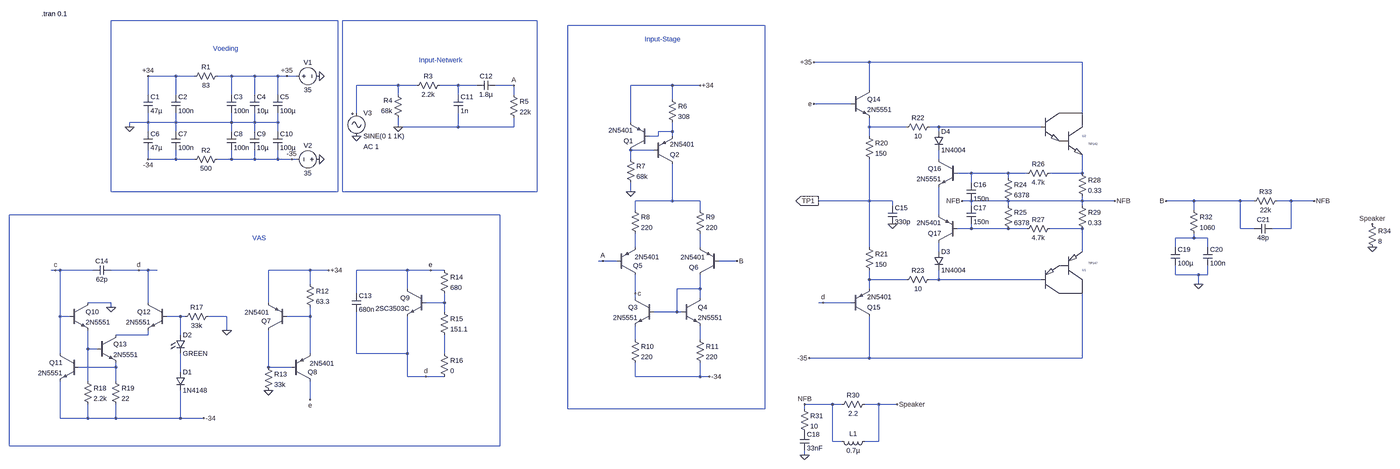
[diagram p0: schematic Lab_AB.asc, whole sheet]
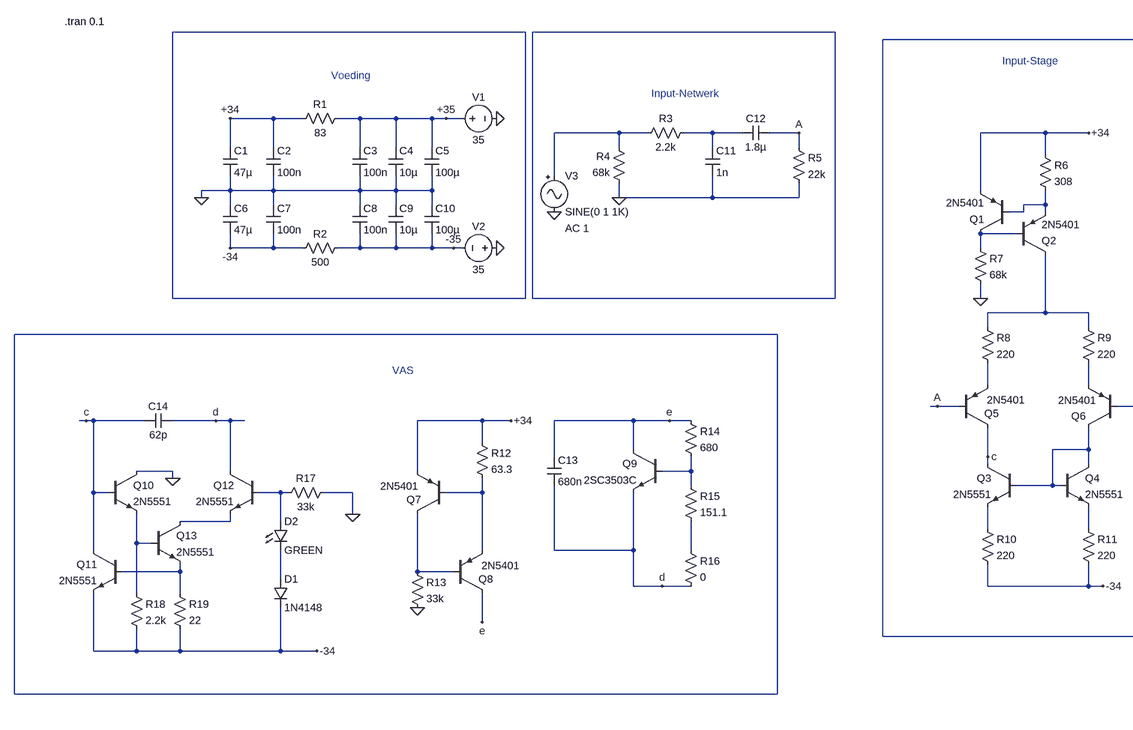
[diagram p1: schematic Lab_AB.asc, part, row 1 of 1, column 1 of 2]
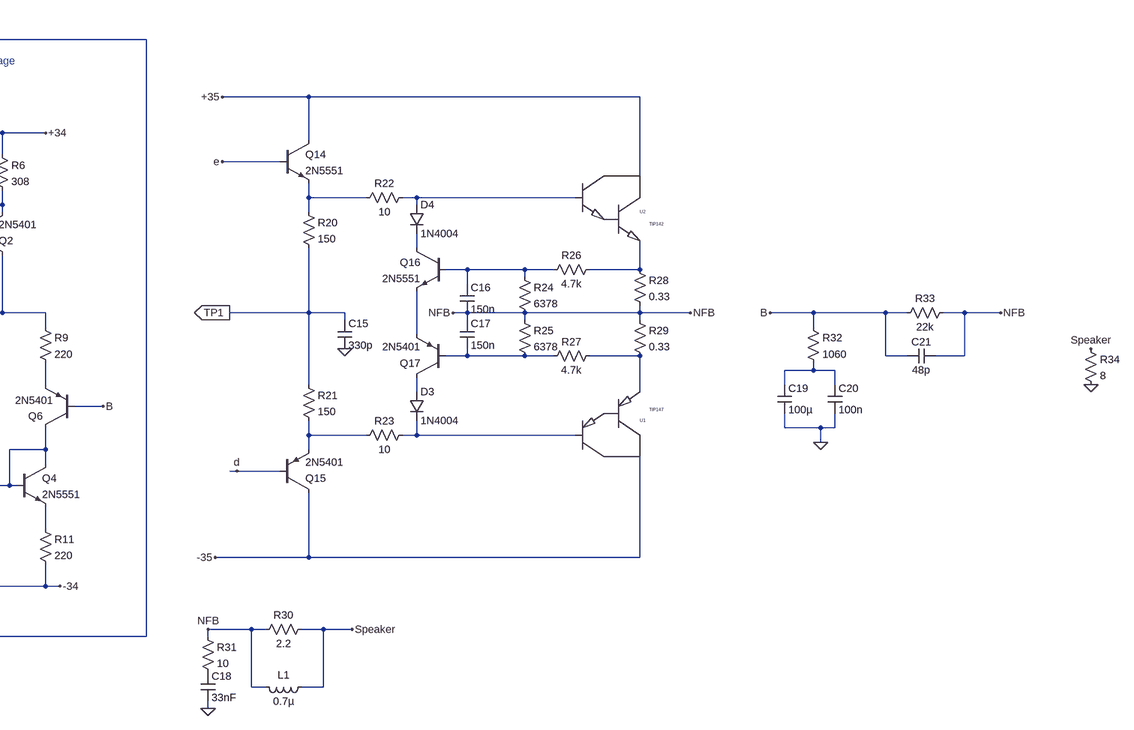
[diagram p2: schematic Lab_AB.asc, part, row 1 of 1, column 2 of 2]
Lab_AB.asc, the LTspice schematic file:
Version 4
SHEET 1 3780 2308
WIRE -128 -256 -912 -256
WIRE 560 -256 -112 -256
WIRE 1376 -240 688 -240
WIRE 1792 -112 1600 -112
WIRE 2528 -112 1792 -112
WIRE -688 -64 -784 -64
WIRE -624 -64 -688 -64
WIRE -496 -64 -544 -64
WIRE -416 -64 -496 -64
WIRE -336 -64 -416 -64
WIRE -304 -64 -336 -64
WIRE -272 -64 -304 -64
WIRE 80 -32 -64 -32
WIRE 144 -32 80 -32
WIRE 288 -32 224 -32
WIRE 352 -32 288 -32
WIRE 480 -32 416 -32
WIRE 1056 -32 912 -32
WIRE 1152 -32 1056 -32
WIRE 1792 -16 1792 -112
WIRE -784 0 -784 -64
WIRE -688 0 -688 -64
WIRE -496 0 -496 -64
WIRE -416 0 -416 -64
WIRE -336 0 -336 -64
WIRE 80 0 80 -32
WIRE 288 0 288 -32
WIRE 480 0 480 -32
WIRE 1056 16 1056 -32
WIRE 1728 32 1600 32
WIRE -64 64 -64 -32
WIRE 2528 64 2528 -112
WIRE -784 96 -784 64
WIRE -784 96 -848 96
WIRE -688 96 -688 64
WIRE -688 96 -784 96
WIRE -496 96 -496 64
WIRE -496 96 -688 96
WIRE -416 96 -416 64
WIRE -416 96 -496 96
WIRE -336 96 -336 64
WIRE -336 96 -416 96
WIRE 912 96 912 -32
WIRE -848 112 -848 96
WIRE 80 112 80 80
WIRE 288 112 288 64
WIRE 288 112 80 112
WIRE 480 112 480 80
WIRE 480 112 288 112
WIRE 1792 112 1792 80
WIRE 1920 112 1792 112
WIRE 2032 112 2000 112
WIRE 2384 112 2032 112
WIRE -784 128 -784 96
WIRE -688 128 -688 96
WIRE -496 128 -496 96
WIRE -416 128 -416 96
WIRE -336 128 -336 96
WIRE 1056 128 1056 96
WIRE 1056 128 1008 128
WIRE 2032 128 2032 112
WIRE 1008 144 1008 128
WIRE 1008 144 976 144
WIRE 1056 144 1056 128
WIRE 1792 144 1792 112
WIRE 992 192 912 192
WIRE -784 224 -784 192
WIRE -688 224 -688 192
WIRE -688 224 -784 224
WIRE -624 224 -688 224
WIRE -496 224 -496 192
WIRE -496 224 -544 224
WIRE -416 224 -416 192
WIRE -416 224 -496 224
WIRE -336 224 -336 192
WIRE -336 224 -416 224
WIRE -288 224 -336 224
WIRE -272 224 -288 224
WIRE 912 224 912 192
WIRE 2032 224 2032 192
WIRE 2144 272 2096 272
WIRE 2272 272 2144 272
WIRE 2336 272 2272 272
WIRE 2528 272 2528 208
WIRE 2528 272 2416 272
WIRE 2272 288 2272 272
WIRE 2144 304 2144 272
WIRE -912 336 -912 -256
WIRE -128 336 -128 -256
WIRE -128 336 -912 336
WIRE -112 336 -112 -256
WIRE 560 336 560 -256
WIRE 560 336 -112 336
WIRE 912 336 912 304
WIRE 1056 368 1056 240
WIRE 1056 368 928 368
WIRE 1152 368 1056 368
WIRE 1792 368 1792 224
WIRE 1792 368 1616 368
WIRE 1872 368 1792 368
WIRE 2144 368 2112 368
WIRE 2272 368 2144 368
WIRE 2528 368 2528 352
WIRE 2528 368 2272 368
WIRE 2640 368 2528 368
WIRE 2960 368 2864 368
WIRE 3120 368 2960 368
WIRE 3168 368 3120 368
WIRE 3296 368 3248 368
WIRE 3376 368 3296 368
WIRE 1872 384 1872 368
WIRE 2144 384 2144 368
WIRE 2272 384 2272 368
WIRE 2528 384 2528 368
WIRE 928 400 928 368
WIRE 1152 400 1152 368
WIRE 2960 400 2960 368
WIRE 432 416 -1264 416
WIRE 2032 416 2032 320
WIRE 2144 464 2144 448
WIRE 2144 464 2096 464
WIRE 2272 464 2144 464
WIRE 2336 464 2272 464
WIRE 2528 464 2416 464
WIRE 3120 464 3120 368
WIRE 3168 464 3120 464
WIRE 3296 464 3296 368
WIRE 3296 464 3232 464
WIRE 2960 496 2960 480
WIRE 2960 496 2896 496
WIRE 3008 496 2960 496
WIRE 928 528 928 480
WIRE 1152 528 1152 480
WIRE 1792 528 1792 368
WIRE 2896 528 2896 496
WIRE 3008 528 3008 496
WIRE 2032 544 2032 512
WIRE 2528 544 2528 464
WIRE 816 576 800 576
WIRE 864 576 816 576
WIRE 1280 576 1216 576
WIRE -1104 608 -1120 608
WIRE -1088 608 -1104 608
WIRE -976 608 -1088 608
WIRE -816 608 -912 608
WIRE -784 608 -816 608
WIRE -752 608 -784 608
WIRE -224 608 -368 608
WIRE -160 608 -224 608
WIRE 112 608 -64 608
WIRE 192 608 112 608
WIRE 240 608 192 608
WIRE 2896 624 2896 592
WIRE 2976 624 2896 624
WIRE 3008 624 3008 592
WIRE 3008 624 2976 624
WIRE 1792 640 1792 608
WIRE 1920 640 1792 640
WIRE 2032 640 2032 608
WIRE 2032 640 2000 640
WIRE 2384 640 2032 640
WIRE -224 656 -224 608
WIRE 2976 656 2976 624
WIRE 112 672 112 608
WIRE 1152 672 1152 624
WIRE 1152 672 1072 672
WIRE 1792 672 1792 640
WIRE -64 688 -64 608
WIRE 928 688 928 624
WIRE 928 704 928 688
WIRE 1152 704 1152 672
WIRE -912 720 -992 720
WIRE -784 720 -784 608
WIRE -368 720 -368 608
WIRE 240 720 240 688
WIRE 240 720 176 720
WIRE 1632 720 1616 720
WIRE 1728 720 1632 720
WIRE -912 736 -912 720
WIRE 240 752 240 720
WIRE 1072 752 1072 672
WIRE 1072 752 992 752
WIRE 1088 752 1072 752
WIRE -1088 768 -1088 608
WIRE -1056 768 -1088 768
WIRE -672 768 -720 768
WIRE -656 768 -672 768
WIRE -512 768 -576 768
WIRE -224 768 -224 736
WIRE -224 768 -304 768
WIRE -512 816 -512 768
WIRE -784 832 -784 816
WIRE -784 832 -896 832
WIRE -672 832 -672 768
WIRE 928 848 928 800
WIRE 1152 848 1152 800
WIRE -992 880 -992 816
WIRE -960 880 -992 880
WIRE -1088 896 -1088 768
WIRE -224 896 -224 768
WIRE -64 896 -64 752
WIRE 112 896 112 768
WIRE 112 896 -64 896
WIRE 240 896 240 832
WIRE 1792 912 1792 768
WIRE 1792 912 1584 912
WIRE 2528 912 2528 688
WIRE 2528 912 1792 912
WIRE -896 944 -896 928
WIRE -896 944 -1024 944
WIRE -368 944 -368 816
WIRE -288 944 -368 944
WIRE -672 960 -672 896
WIRE 112 976 112 896
WIRE 176 976 112 976
WIRE 240 976 176 976
WIRE 928 976 928 928
WIRE 1152 976 1152 928
WIRE 1152 976 928 976
WIRE 1184 976 1152 976
WIRE -992 992 -992 880
WIRE -896 992 -896 944
WIRE -224 1056 -224 992
WIRE 1664 1072 1568 1072
WIRE 1696 1072 1664 1072
WIRE 1824 1072 1776 1072
WIRE 1888 1072 1824 1072
WIRE 688 1088 688 -240
WIRE 1376 1088 1376 -240
WIRE 1376 1088 688 1088
WIRE 1568 1088 1568 1072
WIRE -1088 1120 -1088 992
WIRE -992 1120 -992 1072
WIRE -992 1120 -1088 1120
WIRE -896 1120 -896 1072
WIRE -896 1120 -992 1120
WIRE -672 1120 -672 1024
WIRE -672 1120 -896 1120
WIRE -592 1120 -672 1120
WIRE 1664 1200 1664 1072
WIRE 1696 1200 1664 1200
WIRE 1824 1200 1824 1072
WIRE 1824 1200 1776 1200
WIRE -1264 1216 -1264 416
WIRE 432 1216 432 416
WIRE 432 1216 -1264 1216
WIRE 1568 1248 1568 1232
FLAG -848 112 0
FLAG -192 224 0
FLAG -192 -64 0
FLAG -64 144 0
FLAG 80 112 0
FLAG 912 336 0
FLAG -368 1024 0
FLAG 176 976 d
FLAG 192 608 e
FLAG -912 736 0
FLAG -512 816 0
FLAG -816 608 d
FLAG -1104 608 c
FLAG -288 224 -35
FLAG -304 -64 +35
FLAG -784 -64 +34
FLAG -784 224 -34
FLAG -160 608 +34
FLAG -592 1120 -34
FLAG 480 -32 A
FLAG -224 1056 e
FLAG 928 688 c
FLAG 1616 368 TP1
IOPIN 1616 368 Out
FLAG 1872 448 0
FLAG 2112 368 NFB
FLAG 1568 1248 0
FLAG 1888 1072 Speaker
FLAG 1600 -112 +35
FLAG 1584 912 -35
FLAG 1632 720 d
FLAG 1600 32 e
FLAG 816 576 A
FLAG 2976 656 0
FLAG 3376 368 NFB
FLAG 2864 368 B
FLAG 1280 576 B
FLAG 3600 528 0
FLAG 3600 448 Speaker
FLAG 2640 368 NFB
FLAG 1568 1072 NFB
FLAG 1152 -32 +34
FLAG 1184 976 -34
SYMBOL cap -800 0 R0
SYMATTR InstName C1
SYMATTR Value 47µ
SYMBOL cap -704 0 R0
SYMATTR InstName C2
SYMATTR Value 100n
SYMBOL cap -512 0 R0
SYMATTR InstName C3
SYMATTR Value 100n
SYMBOL cap -432 0 R0
SYMATTR InstName C4
SYMATTR Value 10µ
SYMBOL cap -352 0 R0
SYMATTR InstName C5
SYMATTR Value 100µ
SYMBOL res -528 -80 R90
WINDOW 0 0 56 VBottom 2
WINDOW 3 32 56 VTop 2
SYMATTR InstName R1
SYMATTR Value 83
SYMBOL res -528 208 R90
WINDOW 0 0 56 VBottom 2
WINDOW 3 32 56 VTop 2
SYMATTR InstName R2
SYMATTR Value 500
SYMBOL cap -800 128 R0
SYMATTR InstName C6
SYMATTR Value 47µ
SYMBOL cap -704 128 R0
SYMATTR InstName C7
SYMATTR Value 100n
SYMBOL cap -512 128 R0
SYMATTR InstName C8
SYMATTR Value 100n
SYMBOL cap -432 128 R0
SYMATTR InstName C9
SYMATTR Value 10µ
SYMBOL cap -352 128 R0
SYMATTR InstName C10
SYMATTR Value 100µ
SYMBOL voltage -288 -64 R270
WINDOW 0 32 56 VTop 2
WINDOW 3 -32 56 VBottom 2
WINDOW 123 0 0 Left 0
WINDOW 39 0 0 Left 0
SYMATTR InstName V1
SYMATTR Value 35
SYMBOL voltage -176 224 R90
WINDOW 0 -32 56 VBottom 2
WINDOW 3 32 56 VTop 2
WINDOW 123 0 0 Left 0
WINDOW 39 0 0 Left 0
SYMATTR InstName V2
SYMATTR Value 35
SYMBOL res 240 -48 R90
WINDOW 0 0 56 VBottom 2
WINDOW 3 32 56 VTop 2
SYMATTR InstName R3
SYMATTR Value 2.2k
SYMBOL res 96 96 R180
WINDOW 0 36 76 Left 2
WINDOW 3 36 40 Left 2
SYMATTR InstName R4
SYMATTR Value 68k
SYMBOL cap 272 0 R0
SYMATTR InstName C11
SYMATTR Value 1n
SYMBOL cap 416 -48 R90
WINDOW 0 0 32 VBottom 2
WINDOW 3 32 32 VTop 2
SYMATTR InstName C12
SYMATTR Value 1.8µ
SYMBOL res 464 -16 R0
SYMATTR InstName R5
SYMATTR Value 22k
SYMBOL Misc\\signal -64 48 R0
WINDOW 123 24 132 Left 2
WINDOW 39 0 0 Left 0
SYMATTR Value2 AC 1
SYMATTR InstName V3
SYMBOL res 1040 0 R0
SYMATTR InstName R6
SYMATTR Value 308
SYMBOL res 896 208 R0
SYMATTR InstName R7
SYMATTR Value 68k
SYMBOL pnp 976 192 R180
SYMATTR InstName Q1
SYMATTR Value 2N5401
SYMBOL pnp 992 240 M180
SYMATTR InstName Q2
SYMATTR Value 2N5401
SYMBOL res 912 384 R0
SYMATTR InstName R8
SYMATTR Value 220
SYMBOL res 1136 384 R0
SYMATTR InstName R9
SYMATTR Value 220
SYMBOL pnp 864 624 M180
WINDOW 0 56 32 Left 2
WINDOW 3 62 62 Left 2
SYMATTR InstName Q5
SYMATTR Value 2N5401
SYMBOL pnp 1216 624 R180
WINDOW 0 70 26 Left 2
WINDOW 3 47 61 Left 2
SYMATTR InstName Q6
SYMATTR Value 2N5401
SYMBOL npn 992 704 M0
SYMATTR InstName Q3
SYMATTR Value 2N5551
SYMBOL npn 1088 704 R0
SYMATTR InstName Q4
SYMATTR Value 2N5551
SYMBOL res 912 832 R0
SYMATTR InstName R10
SYMATTR Value 220
SYMBOL res 1136 832 R0
SYMATTR InstName R11
SYMATTR Value 220
SYMBOL res -240 640 R0
SYMATTR InstName R12
SYMATTR Value 63.3
SYMBOL pnp -304 816 R180
WINDOW 0 56 32 Left 2
WINDOW 3 62 62 Left 2
SYMATTR InstName Q7
SYMATTR Value 2N5401
SYMBOL res -384 928 R0
SYMATTR InstName R13
SYMATTR Value 33k
SYMBOL pnp -288 992 M180
WINDOW 0 56 32 Left 2
WINDOW 3 62 62 Left 2
SYMATTR InstName Q8
SYMATTR Value 2N5401
SYMBOL res 224 592 R0
SYMATTR InstName R14
SYMATTR Value 680
SYMBOL res 224 736 R0
SYMATTR InstName R15
SYMATTR Value 151.1
SYMBOL cap -80 688 R0
SYMATTR InstName C13
SYMATTR Value 680n
SYMBOL npn 176 672 M0
SYMATTR InstName Q9
SYMATTR Value 2SC3503C
SYMBOL res 224 880 R0
SYMATTR InstName R16
SYMATTR Value 0
SYMBOL cap -912 592 R90
WINDOW 0 0 32 VBottom 2
WINDOW 3 32 32 VTop 2
SYMATTR InstName C14
SYMATTR Value 62p
SYMBOL npn -1056 720 R0
SYMATTR InstName Q10
SYMATTR Value 2N5551
SYMBOL npn -1024 896 M0
SYMATTR InstName Q11
SYMATTR Value 2N5551
SYMBOL npn -720 720 M0
SYMATTR InstName Q12
SYMATTR Value 2N5551
SYMBOL npn -960 832 R0
SYMATTR InstName Q13
SYMATTR Value 2N5551
SYMBOL res -560 752 R90
WINDOW 0 0 56 VBottom 2
WINDOW 3 32 56 VTop 2
SYMATTR InstName R17
SYMATTR Value 33k
SYMBOL diode -688 960 R0
SYMATTR InstName D1
SYMATTR Value 1N4148
SYMBOL LED -688 832 R0
SYMATTR InstName D2
SYMATTR Value GREEN
SYMBOL res -1008 976 R0
SYMATTR InstName R18
SYMATTR Value 2.2k
SYMBOL res -912 976 R0
SYMATTR InstName R19
SYMATTR Value 22
SYMBOL npn 1728 -16 R0
SYMATTR InstName Q14
SYMATTR Value 2N5551
SYMBOL res 1776 128 R0
SYMATTR InstName R20
SYMATTR Value 150
SYMBOL res 1776 512 R0
SYMATTR InstName R21
SYMATTR Value 150
SYMBOL pnp 1728 768 M180
SYMATTR InstName Q15
SYMATTR Value 2N5401
SYMBOL res 2016 96 R90
WINDOW 0 0 56 VBottom 2
WINDOW 3 32 56 VTop 2
SYMATTR InstName R22
SYMATTR Value 10
SYMBOL res 2016 624 R90
WINDOW 0 0 56 VBottom 2
WINDOW 3 32 56 VTop 2
SYMATTR InstName R23
SYMATTR Value 10
SYMBOL cap 1856 384 R0
SYMATTR InstName C15
SYMATTR Value 330p
SYMBOL diode 2016 544 R0
SYMATTR InstName D3
SYMATTR Value 1N4004
SYMBOL diode 2016 128 R0
SYMATTR InstName D4
SYMATTR Value 1N4004
SYMBOL npn 2096 224 M0
SYMATTR InstName Q16
SYMATTR Value 2N5551
SYMBOL pnp 2096 512 R180
SYMATTR InstName Q17
SYMATTR Value 2N5401
SYMBOL cap 2128 304 R0
SYMATTR InstName C16
SYMATTR Value 150n
SYMBOL cap 2128 384 R0
SYMATTR InstName C17
SYMATTR Value 150n
SYMBOL res 2256 272 R0
SYMATTR InstName R24
SYMATTR Value 6378
SYMBOL res 2256 368 R0
SYMATTR InstName R25
SYMATTR Value 6378
SYMBOL res 2432 256 R90
WINDOW 0 0 56 VBottom 2
WINDOW 3 32 56 VTop 2
SYMATTR InstName R26
SYMATTR Value 4.7k
SYMBOL res 2432 448 R90
WINDOW 0 0 56 VBottom 2
WINDOW 3 32 56 VTop 2
SYMATTR InstName R27
SYMATTR Value 4.7k
SYMBOL res 2512 256 R0
SYMATTR InstName R28
SYMATTR Value 0.33
SYMBOL res 2512 368 R0
SYMATTR InstName R29
SYMATTR Value 0.33
SYMBOL res 1792 1056 R90
WINDOW 0 0 56 VBottom 2
WINDOW 3 32 56 VTop 2
SYMATTR InstName R30
SYMATTR Value 2.2
SYMBOL ind 1792 1184 R90
WINDOW 0 5 56 VBottom 2
WINDOW 3 32 56 VTop 2
SYMATTR InstName L1
SYMATTR Value 0.7µ
SYMBOL res 1552 1072 R0
SYMATTR InstName R31
SYMATTR Value 10
SYMBOL cap 1552 1168 R0
SYMATTR InstName C18
SYMATTR Value 33nF
SYMBOL TIP147 2384 688 M180
SYMATTR InstName U1
SYMBOL TIP142 2400 64 R0
SYMATTR InstName U2
SYMBOL res 2944 384 R0
SYMATTR InstName R32
SYMATTR Value 1060
SYMBOL cap 2880 528 R0
SYMATTR InstName C19
SYMATTR Value 100µ
SYMBOL cap 2992 528 R0
SYMATTR InstName C20
SYMATTR Value 100n
SYMBOL cap 3232 448 R90
WINDOW 0 0 32 VBottom 2
WINDOW 3 32 32 VTop 2
SYMATTR InstName C21
SYMATTR Value 48p
SYMBOL res 3264 352 R90
WINDOW 0 0 56 VBottom 2
WINDOW 3 32 56 VTop 2
SYMATTR InstName R33
SYMATTR Value 22k
SYMBOL res 3584 432 R0
SYMATTR InstName R34
SYMATTR Value 8
TEXT -1152 -280 Left 2 !.tran 0.1
TEXT -560 -160 Left 2 ;Voeding
TEXT 152 -120 Left 2 ;Input-Netwerk
TEXT 960 -192 Left 2 ;Input-Stage
TEXT -424 496 Left 2 ;VAS

The netlist it stands for:
* Lab_AB.asc
C1 +34 0 47µ
C2 +34 0 100n
C3 +35 0 100n
C4 +35 0 10µ
C5 +35 0 100µ
R1 +35 +34 83
R2 -35 -34 500
C6 0 -34 47µ
C7 0 -34 100n
C8 0 -35 100n
C9 0 -35 10µ
C10 0 -35 100µ
V1 +35 0 35
V2 0 -35 35
R3 N005 N004 2.2k
R4 0 N004 68k
C11 N005 0 1n
C12 A N005 1.8µ
R5 A 0 22k
V3 N004 0 SINE(0 1 1K) AC 1
R6 +34 N008 308
R7 N009 0 68k
Q1 N009 N008 +34 0 2N5401
Q2 N013 N009 N008 0 2N5401
R8 N013 N019 220
R9 N013 N020 220
Q5 c A N019 0 2N5401
Q6 N024 B N020 0 2N5401
Q3 c N024 N029 0 2N5551
Q4 N024 N024 N030 0 2N5551
R10 N029 -34 220
R11 N030 -34 220
R12 +34 N027 63.3
Q7 N034 N027 +34 0 2N5401
R13 N034 0 33k
Q8 e N034 N027 0 2N5401
R14 e N025 680
R15 N025 N032 151.1
C13 e d 680n
Q9 e N025 d 0 2SC3503C
R16 N032 d 0
C14 d c 62p
Q10 0 c N031 0 2N5551
Q11 c N033 -34 0 2N5551
Q12 d N026 N028 0 2N5551
Q13 N028 N031 N033 0 2N5551
R17 0 N026 33k
D1 N035 -34 1N4148
D2 N026 N035 GREEN
R18 N031 -34 2.2k
R19 N033 -34 22
Q14 +35 e N006 0 2N5551
R20 N006 TP1 150
R21 TP1 N022 150
Q15 -35 d N022 0 2N5401
R22 N007 N006 10
R23 N023 N022 10
C15 TP1 0 330p
D3 N021 N023 1N4004
D4 N007 N010 1N4004
Q16 N010 N011 N015 0 2N5551
Q17 N021 N016 N015 0 2N5401
C16 N011 NFB 150n
C17 NFB N016 150n
R24 N011 NFB 6378
R25 NFB N016 6378
R26 N012 N011 4.7k
R27 N017 N016 4.7k
R28 N012 NFB 0.33
R29 NFB N017 0.33
R30 Speaker NFB 2.2
L1 Speaker NFB 0.7µ
R31 NFB P001 10
C18 P001 0 33nF
XU1 -35 N023 N017 TIP147  ; pins C B E
XU2 +35 N007 N012 TIP142  ; pins C B E
R32 B N018 1060
C19 N018 0 100µ
C20 N018 0 100n
C21 NFB B 48p
R33 NFB B 22k
R34 Speaker 0 8
.model D D
.lib standard.dio
.model NPN NPN
.model PNP PNP
.lib standard.bjt
.tran 0.1
* Voeding
* Input-Netwerk
* Input-Stage
* VAS
.lib TIP147.sub
.lib TIP142.sub
.backanno
.end